# EAGLE schematic Preamp (EAGLE 9.6.2)
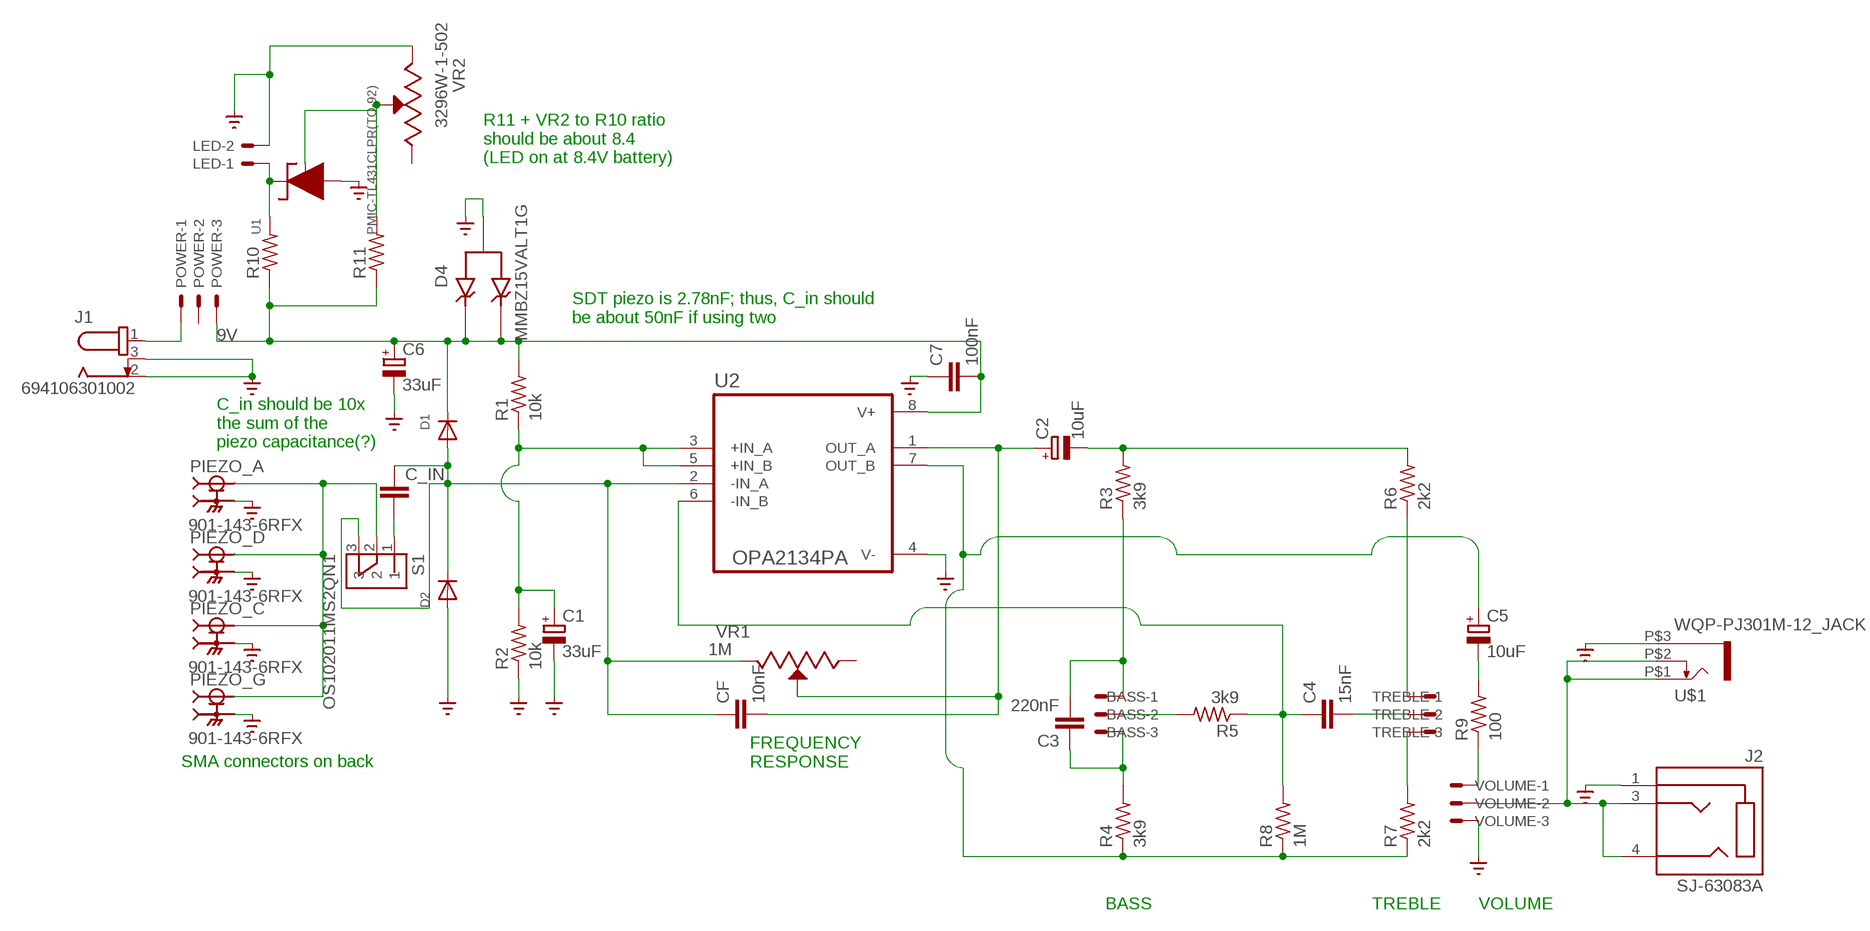
[diagram p0: schematic, sheet 1]

## Parts
BASS  JST-XH-03-PIN-LONG-PAD  [JST-XH-03-PACKAGE-LONG-PAD]
C1  33uF  CPOL-EUE2.5-6  [E2,5-6]
C2  10uF  CPOL-EUE2.5-6  [E2,5-6]
C3  220nF  C-EUC1206  [C1206]
C4  15nF  C-EUC1206  [C1206]
C5  10uF  CPOL-EUE2.5-6  [E2,5-6]
C6  33uF  CPOL-EUE2.5-6  [E2,5-6]
C7  100nF  C-EUC0603  [C0603]
C_IN  C-EUC0603  [C0603]
CF  10nF  C-EUC1206  [C1206]
D1  DIODEDO-1N4148  [DO-1N4148]
D2  DIODEDO-1N4148  [DO-1N4148]
D4  MMBZ15VALT1G  [SOT95P237X111-3N]
J1  694106301002  [694106301002]
J2  SJ-63083A  [CUI_SJ-63083A]
LED  JST-XH-02-PIN-ROUND-PAD  [JST-XH-02-PACKAGE-ROUND-PAD]
PIEZO_A  901-143-6RFX  [AMPHENOL_901-143-6RFX]
PIEZO_C  901-143-6RFX  [AMPHENOL_901-143-6RFX]
PIEZO_D  901-143-6RFX  [AMPHENOL_901-143-6RFX]
PIEZO_G  901-143-6RFX  [AMPHENOL_901-143-6RFX]
POWER  JST-XH-03-PIN-LONG-PAD  [JST-XH-03-PACKAGE-LONG-PAD]
R1  10k  R-US_R1206  [R1206]
R2  10k  R-US_R1206  [R1206]
R3  3k9  R-US_R1206  [R1206]
R4  3k9  R-US_R1206  [R1206]
R5  3k9  R-US_R1206  [R1206]
R6  2k2  R-US_R1206  [R1206]
R7  2k2  R-US_R1206  [R1206]
R8  1M  R-US_R1206  [R1206]
R9  100  R-US_R1206  [R1206]
R10  R-US_R1206  [R1206]
R11  R-US_R1206  [R1206]
S1  OS102011MS2QN1  [SW_OS102011MS2QN1]
TREBLE  JST-XH-03-PIN-LONG-PAD  [JST-XH-03-PACKAGE-LONG-PAD]
U1  PMIC-TL431CLPR(TO-92)  [TO-92]
U2  OPA2134PA  [DIP794W45P254L959H508Q8]
U$1  WQP-PJ301M-12_JACK  [WQP-PJ301M-12_JACK]
VOLUME  JST-XH-03-PIN-LONG-PAD  [JST-XH-03-PACKAGE-LONG-PAD]
VR1  1M  3296W-1-502  [TRIM_3296W-1-502]
VR2  3296W-1-502  [TRIM_3296W-1-502]

## Nets
9V: C6.+ C7.2 D1.C D4.1(K1) D4.2(K2) POWER.3 R1.2 R10.1 R11.1 U2.8(V+)
GND: C1.- C6.- C7.1 D2.A D4.3(A) J1.2 J1.3 J2.1(SLEEVE) LED.2 PIEZO_A.S1 PIEZO_A.S2 PIEZO_A.S3 PIEZO_A.S4 PIEZO_C.S1 PIEZO_C.S2 PIEZO_C.S3 PIEZO_C.S4 PIEZO_D.S1 PIEZO_D.S2 PIEZO_D.S3 PIEZO_D.S4 PIEZO_G.S1 PIEZO_G.S2 PIEZO_G.S3 PIEZO_G.S4 R2.1 U1.2(ANODE) U2.4(V-) U$1.P$3 VOLUME.3 VR2.3(CW) ; supply symbol labelled SUPPLY0_GND_
N$1: C_IN.1 CF.1 D1.A D2.C S1.3 U2.2(-IN_A) VR1.3(CW)
N$2: PIEZO_A.1 PIEZO_C.1 PIEZO_D.1 PIEZO_G.1 S1.2
N$3: C1.+ R1.1 R2.2 U2.3(+IN_A) U2.5(+IN_B)
N$4: C2.+ CF.2 U2.1(OUT_A) VR1.2(WIPER)
N$5: C_IN.2 S1.1
N$6: C2.- R3.2 R6.2
N$7: BASS.1 C3.2 R3.1
N$8: C4.1 R5.1 R8.2 U2.6(-IN_B)
N$9: C5.- R9.2
N$10: BASS.2 R5.2
N$11: R6.1 TREBLE.1
N$12: R7.2 TREBLE.3
N$13: C4.2 TREBLE.2
N$14: BASS.3 C3.1 R4.2
N$15: C5.+ R4.1 R7.1 R8.1 U2.7(OUT_B)
N$16: R9.1 VOLUME.1
N$17: J1.1 POWER.1
N$18: J2.3(TIP) J2.4(RING) U$1.P$1 U$1.P$2 VOLUME.2
N$19: R11.2 U1.3(REF) VR2.2(WIPER)
N$20: LED.1 R10.2 U1.1(CATHODE)
Unconnected: POWER.2 VR1.1(CCW) VR2.1(CCW)

## Notes on the sheet
- R11 + VR2 to R10 ratio
  should be about 8.4
  (LED on at 8.4V battery)
- SDT piezo is 2.78nF; thus, C_in should 
  be about 50nF if using two
- C_in should be 10x 
  the sum of the
  piezo capacitance(?)
- SMA connectors on back
- FREQUENCY
  RESPONSE
- BASS | TREBLE | VOLUME

## Library data of the parts
BASS POWER TREBLE VOLUME = Rembrandt Electronics - JST XH Connectors v1-0:JST-XH-03-PIN: JST XH Connector 2 Pin Wire to board connector. Pitch: 2,54 mm, (0.100") Number of pins: 3 Created by Rembrandt Electronics www.rembrandtelectronics.com
C1 C2 C5 C6 = rcl:CPOL-EU: POLARIZED CAPACITOR, European symbol; SPICEPREFIX: C
C3 C4 C7 C_IN CF = rcl:C-EU: CAPACITOR, European symbol; SPICEPREFIX: C
D1 D2 = adafruit:DIODE: Diode SMADIODE - SMA Surface Mount Package 20V 1A Schottky Diode Digikey: 641-1014-6-ND DO-1N4148 - Through Hole Small Current Diode SOD-123 20V 1 A (.5mV Vf) Schottky Diode - Digikey: MBRX120TPMSCT-ND SOD-323 10V 570mA (.38mV Vf, 3ns) Schottky Diode - Digikey: ZLLS410CT-ND SOD-523 30V 30mA Schottky Diode (RB751S-40TE61) - Digikey: RB751S-40TE61CT-ND SOT23-R/W - SOT23 Package (R = Solder Paste/Reflow Ovens, W = Hand-Soldering) BAT54Film 40V 300mA - Digikey: 497-7162-1-ND
D4 = MMBZ15VALT1G:MMBZ15VALT1G: 46V Clamp 870mA Ipp Tvs Diode Surface Mount SOT-23-3 (TO-236); DESCRIPTION: 21V Clamp 1.9A Ipp Tvs Diode Surface Mount SOT-23-3 (TO-236); DIGI-KEY_PART_NUMBER: MMBZ15VALT1GOSCT-ND; MF: ON Semiconductor; MP: MMBZ15VALT1G; PACKAGE: SOT-23-3 ON Semiconductor; PURCHASE-URL: https://pricing.snapeda.com/search/part/MMBZ15VALT1G/?ref=eda
J1 = DC Power Jacks:694106301002: CONN PWR JACK 2.1X5.5MM SOLDER Manufacturer's datasheet <https://katalog.we-online.de/em/datasheet/6941xx301002.pdf>; CREATED_BY: PCBLayout.com; DIGIKEY_PART_NUMBER: 732-5930-ND; MANUFACTURER: Wurth Electronics Inc.; MPN: 694106301002
J2 = SJ-63083A:SJ-63083A; CUI_PURCHASE_URL: https://www.cuidevices.com/product/interconnect/connectors/audio-connectors/jacks/sj-6308-series?utm_source=snapeda.com&utm_medium=referral&utm_campaign=snapedaBOM; DESCRIPTION: 6.35 mm, Stereo, Right Angle, Through Hole, 3 Conductors, 0 Internal Switches, Audio Jack Connector; DIGI-KEY_PART_NUMBER: 2223-SJ-63083A-ND; MF: CUI Devices; MP: SJ-63083A; PACKAGE: None; PURCHASE-URL: https://pricing.snapeda.com/search/part/SJ-63083A/?ref=eda
LED = Rembrandt Electronics - JST XH Connectors v1-0:JST-XH-02-PIN: JST XH Connector 2 Pin Wire to board connector. Pitch: 2,54 mm, (0.100") Number of pins: 2 Created by Rembrandt Electronics www.rembrandtelectronics.com
PIEZO_A PIEZO_C PIEZO_D PIEZO_G = 901-143-6RFX:901-143-6RFX: connector, rf coaxial, sma rt angle pcb jack recept, 4 legs, blunt post term, gold Check prices <https://pricing.snapeda.com/parts/901-143-6RFX/Amphenol%20RF/view-part?ref=eda>; AVAILABILITY: In Stock; DESCRIPTION: SMA Connector Jack, Female Socket 50Ohm Through Hole, Right Angle Solder; MF: Amphenol RF; MP: 901-143-6RFX; PACKAGE: None; PRICE: None
R1-R11 = rcl:R-US_: RESISTOR, American symbol; SPICEPREFIX: R
S1 = OS102011MS2QN1:OS102011MS2QN1: Switch Slide ON ON SPDT Top Slide 0.1A 12VDC 10000Cycles PC Pins Thru-Hole Bulk; DESCRIPTION: SLIDE SWITCH SPDT T/H ON-ON BBM; DIGI-KEY_PART_NUMBER: CKN12284-ND; MF: C&K; MP: OS102011MS2QN1; PACKAGE: None; PURCHASE-URL: https://pricing.snapeda.com/search/part/OS102011MS2QN1/?ref=eda
U1 = TL431CLP:PMIC-TL431CLPR(TO-92): 310030268 Check availability <https://pricing.snapeda.com/parts/TL431CLPR/Texas%20Instruments/view-part?ref=eda>; AVAILABILITY: In Stock; DESCRIPTION: Adjustable precision shunt regulator 3-TO-92 0 to 70; MF: Texas Instruments; MP: TL431CLPR; PACKAGE: TO-92-3 Texas Instruments; PRICE: None; PURCHASE-URL: https://pricing.snapeda.com/search/part/TL431CLPR/?ref=eda
U2 = OPA2134PA:OPA2134PA: Check availability <https://pricing.snapeda.com/parts/OPA2134PA/Texas/view-part?ref=eda>; AVAILABILITY: In Stock; DESCRIPTION: SoundPlus&trade; Audio Operational Amplifier with Low Distortion, Low Noise and Precision 8-PDIP -40 to 85; MF: Texas; MP: OPA2134PA; PACKAGE: PDIP-8 Texas; PRICE: None; PURCHASE-URL: https://pricing.snapeda.com/search/part/OPA2134PA/?ref=eda
U$1 = thonkiconn:WQP-PJ301M-12_JACK
VR1 VR2 = 3296W-1-502:3296W-1-502: Res Cermet Trimmer 500K Ohm 10% 0.5W 25(Elec)Turn 2.19mm (9.53 X 4.83 X 11.55mm) Pin Thru-Hole Tube; DESCRIPTION: 5 kOhms 0.5W, 1/2W PC Pins Through Hole Trimmer Potentiometer Cermet 25 Turn Top Adjustment; DIGI-KEY_PART_NUMBER: 3296W-1-502RLFTR-ND; MF: Bourns; MP: 3296W-1-502; PACKAGE: SOT-23-5 Bourns

## Net classes
0 default: width 0.508 mm